# EAGLE design PX2FMU_testjig (EAGLE 5.11)
BOM: EXCLUDE; PARTNO: 93LC46BT-I/ST
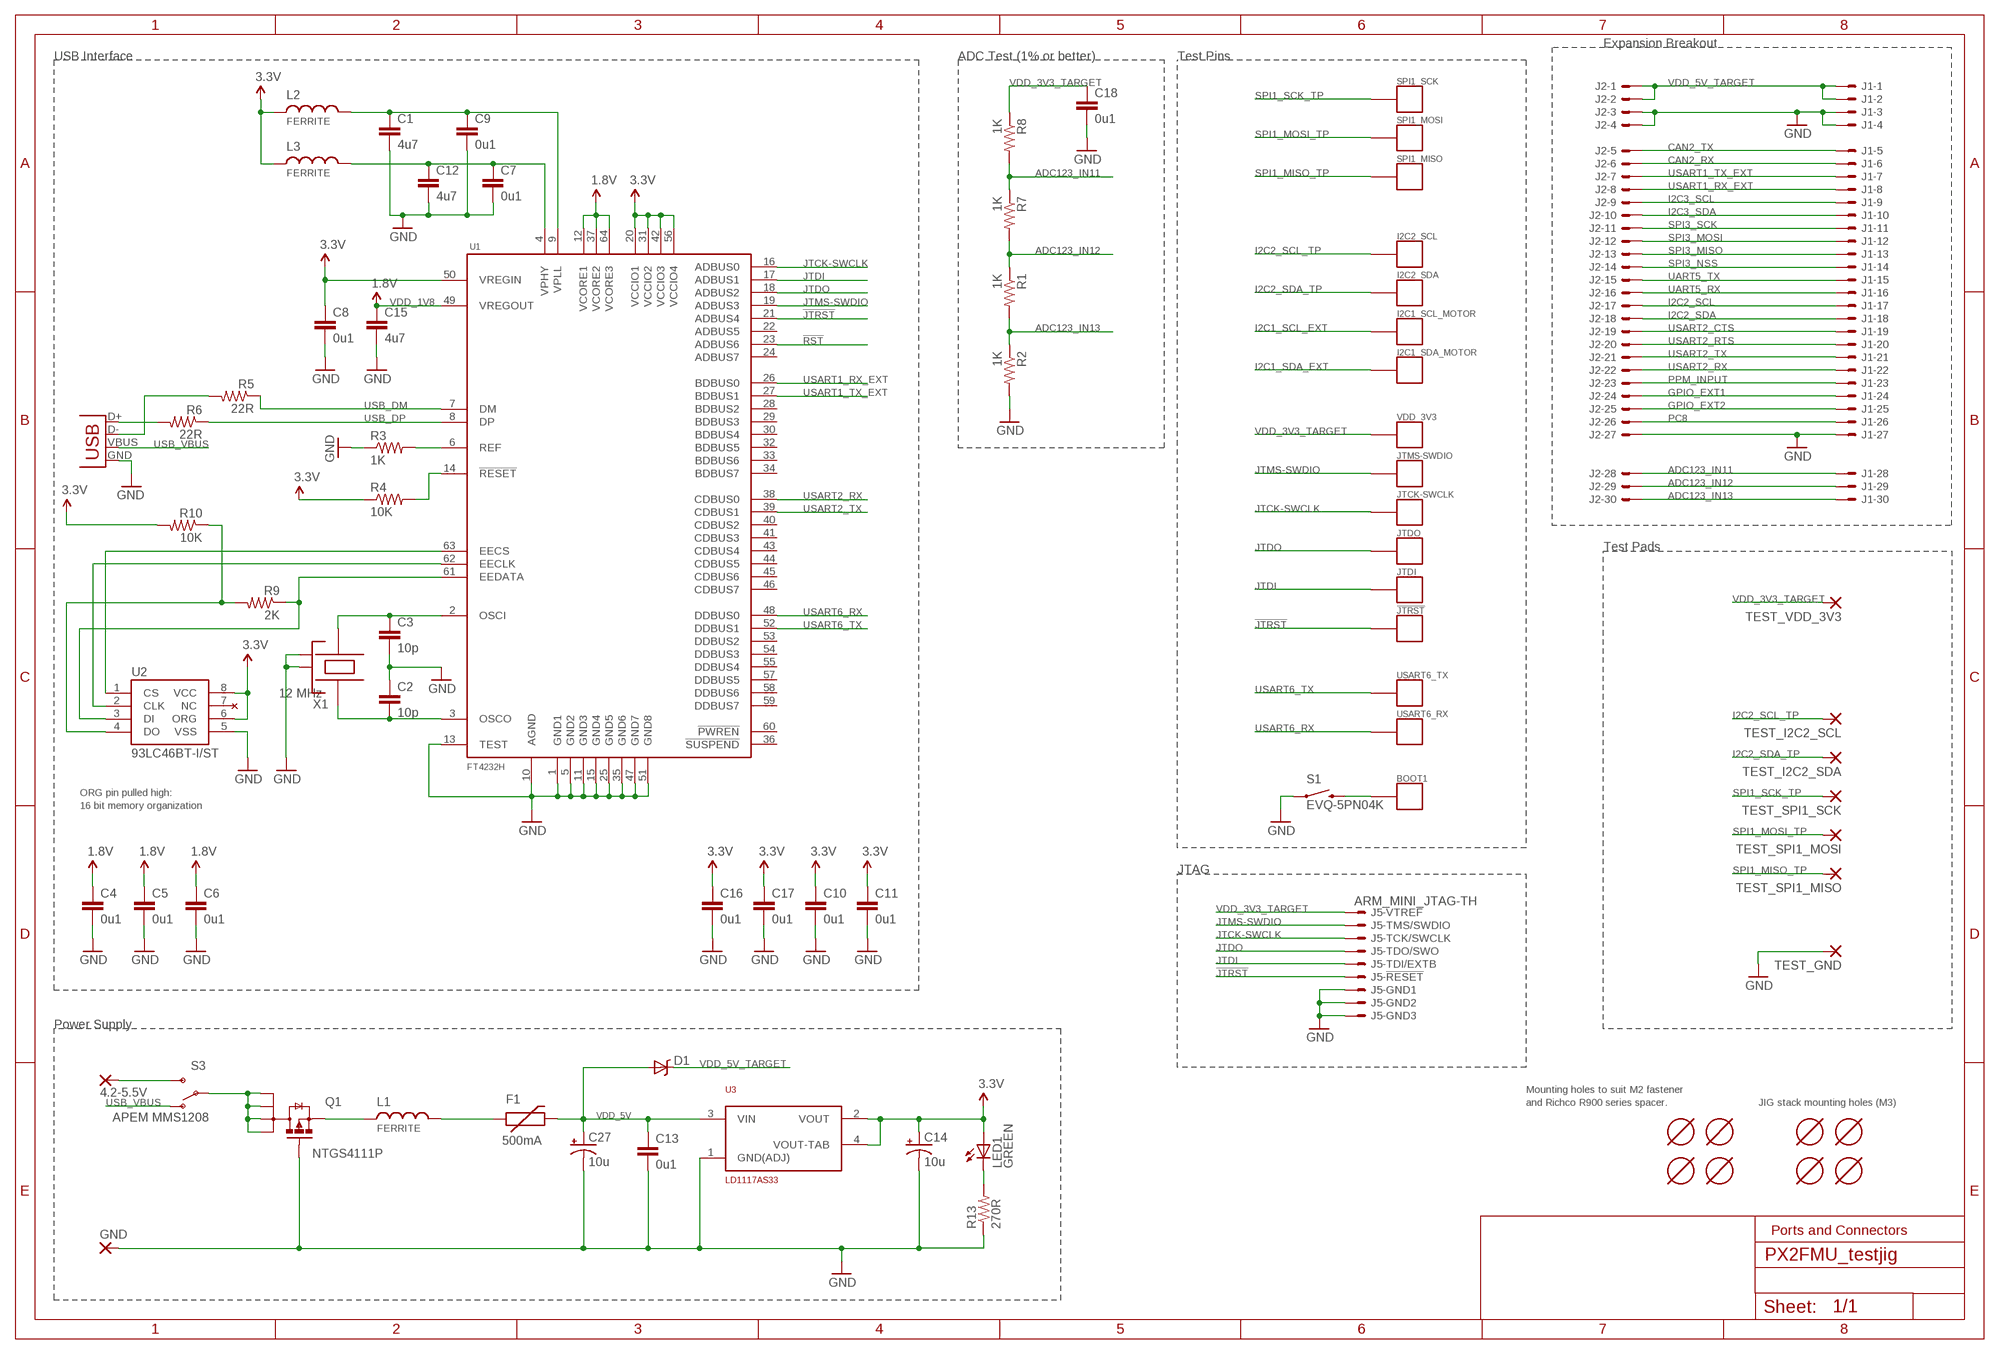
[diagram p0: schematic, sheet 1]

## Parts
4.2-5.5V  WIREPADSMD3,5-2  [3,5-2]
!JTRST  PAD-POGO  [POGO]
BOOT1  PAD-POGO  [POGO]
C1  4u7  CAP0402-CAP  [0402-CAP]
C2  10p  CAP0402-CAP  [0402-CAP]
C3  10p  CAP0402-CAP  [0402-CAP]
C4  0u1  CAP0402-CAP  [0402-CAP]
C5  0u1  CAP0402-CAP  [0402-CAP]
C6  0u1  CAP0402-CAP  [0402-CAP]
C7  0u1  CAP0402-CAP  [0402-CAP]
C8  0u1  CAP0402-CAP  [0402-CAP]
C9  0u1  CAP0402-CAP  [0402-CAP]
C10  0u1  CAP0402-CAP  [0402-CAP]
C11  0u1  CAP0402-CAP  [0402-CAP]
C12  4u7  CAP0402-CAP  [0402-CAP]
C13  0u1  CAP0402-CAP  [0402-CAP]
C14  10u  CAP_POL1206  [EIA3216]
C15  4u7  CAP0402-CAP  [0402-CAP]
C16  0u1  CAP0402-CAP  [0402-CAP]
C17  0u1  CAP0402-CAP  [0402-CAP]
C18  0u1  CAP0402-CAP  [0402-CAP]
C27  10u  CAP_POL1206  [EIA3216]
D1  DIODE-SCHOTTKY_MSMP  [MICROSMP]
F1  500mA  PTC0402  [0402-PTC]
GND  WIREPADSMD3,5-2  [3,5-2]
I2C1_SCL_MOTOR  PAD-POGO  [POGO]
I2C1_SDA_MOTOR  PAD-POGO  [POGO]
I2C2_SCL  PAD-POGO  [POGO]
I2C2_SDA  PAD-POGO  [POGO]
J1  HEADER_2X15  HEADER_2X15-TH-SHROUDED  [HEADER_2.54MM-2X15-SHROUDED_LOCK]
J2  HEADER_2X15-POGO  [HEADER_2MM_2X15_POGO]
J5  ARM_MINI_JTAG-TH  [FTSH-105-01-XXX-DV]
J8  USBSMD  [USB-MINIB]
JTCK-SWCLK  PAD-POGO  [POGO]
JTDI  PAD-POGO  [POGO]
JTDO  PAD-POGO  [POGO]
JTMS-SWDIO  PAD-POGO  [POGO]
L1  FERRITE  INDUCTOR0402  [0402-IND]
L2  FERRITE  INDUCTOR0402  [0402-IND]
L3  FERRITE  INDUCTOR0402  [0402-IND]
LED1  GREEN  LED0603  [LED-0603]
Q1  NTGS4111P  [TSOP-6]
R1  1K  RESISTOR0402-RES  [0402-RES]
R2  1K  RESISTOR0402-RES  [0402-RES]
R3  1K  RESISTOR0402-RES  [0402-RES]
R4  10K  RESISTOR0402-RES  [0402-RES]
R5  22R  RESISTOR0402-RES  [0402-RES]
R6  22R  RESISTOR0402-RES  [0402-RES]
R7  1K  RESISTOR0402-RES  [0402-RES]
R8  1K  RESISTOR0402-RES  [0402-RES]
R9  2K  RESISTOR0402-RES  [0402-RES]
R10  10K  RESISTOR0402-RES  [0402-RES]
R13  270R  RESISTOR0402-RES  [0402-RES]
S1  EVQ-5PN04K  SWITCH-MOMENTARY-2-SMD-1101NE  [TACTILE-SWITCH-1101NE]
S3  APEM MMS1208  SWITCH-SPSTPTH_LOCK  [SWITCH-SPDT_LOCK.007S]
SPI1_MISO  PAD-POGO  [POGO]
SPI1_MOSI  PAD-POGO  [POGO]
SPI1_SCK  PAD-POGO  [POGO]
TEST_GND  WIREPADSMD2.5-1.8  [PAD-2.5-1.8]
TEST_I2C2_SCL  WIREPADSMD2.5-1.8  [PAD-2.5-1.8]
TEST_I2C2_SDA  WIREPADSMD2.5-1.8  [PAD-2.5-1.8]
TEST_SPI1_MISO  WIREPADSMD2.5-1.8  [PAD-2.5-1.8]
TEST_SPI1_MOSI  WIREPADSMD2.5-1.8  [PAD-2.5-1.8]
TEST_SPI1_SCK  WIREPADSMD2.5-1.8  [PAD-2.5-1.8]
TEST_VDD_3V3  WIREPADSMD2.5-1.8  [PAD-2.5-1.8]
U1  FT4232H  [TQFP64]
U2  93LC46BT-I/ST  EEPROM-SERIAL-TSSOP-8  [TSSOP-8]
U3  LD1117AS33  [SOT-223]
U$1  MOUNT-HOLE3.1MM  [MOUNT-HOLE3.1]
U$2  MOUNT-HOLE3.1MM  [MOUNT-HOLE3.1]
U$3  MOUNT-HOLE3.1MM  [MOUNT-HOLE3.1]
U$4  MOUNT-HOLE3.1MM  [MOUNT-HOLE3.1]
U$5  MOUNT-HOLE2.1MM  [MOUNT-HOLE2.1]
U$6  MOUNT-HOLE2.1MM  [MOUNT-HOLE2.1]
U$7  MOUNT-HOLE2.1MM  [MOUNT-HOLE2.1]
U$8  MOUNT-HOLE2.1MM  [MOUNT-HOLE2.1]
USART6_RX  PAD-POGO  [POGO]
USART6_TX  PAD-POGO  [POGO]
VDD_3V3  PAD-POGO  [POGO]
X1  12 MHz  OSCILLATOR-3.2X2.5  [OSCILLATOR-3.2X2.5]

## Nets
!JTRST: !JTRST.P$1 J5.10 U1.21(ADBUS4)
!RST: U1.23(ADBUS6)
ADC123_IN11: J1.28 J2.28 R7.1 R8.2
ADC123_IN12: J1.29 J2.29 R1.1 R7.2
ADC123_IN13: J1.30 J2.30 R1.2 R2.1
BOOT1: BOOT1.P$1 S1.P$2
CAN2_RX: J1.6 J2.6
CAN2_TX: J1.5 J2.5
GND [power]: C1.2 C2.1 C3.2 C4.2 C5.2 C6.2 C7.2 C8.2 C9.2 C10.2 C11.2 C12.2 C13.2 C14.C(-) C15.2 C16.2 C17.2 C18.2 C27.C(-) GND.1(P) J1.3 J1.4 J1.27 J2.3 J2.4 J2.27 J5.3 J5.5 J5.9 J8.GND Q1.3(G) R2.2 R3.1 R13.1 S1.P$1 TEST_GND.P$1(P) U1.1(GND1) U1.5(GND2) U1.10(AGND) U1.11(GND3) U1.13(TEST) U1.15(GND4) U1.25(GND5) U1.35(GND6) U1.47(GND7) U1.51(GND8) U2.5(VSS) U3.1(GND(ADJ)) X1.2(NC_2) X1.4(NC_4)
GPIO_EXT1: J1.24 J2.24
GPIO_EXT2: J1.25 J2.25
I2C1_SCL_EXT: I2C1_SCL_MOTOR.P$1
I2C1_SDA_EXT: I2C1_SDA_MOTOR.P$1
I2C2_SCL: J1.17 J2.17
I2C2_SCL_TP: I2C2_SCL.P$1 TEST_I2C2_SCL.P$1(P)
I2C2_SDA: J1.18 J2.18
I2C2_SDA_TP: I2C2_SDA.P$1 TEST_I2C2_SDA.P$1(P)
I2C3_SCL: J1.9 J2.9
I2C3_SDA: J1.10 J2.10
JTCK-SWCLK: J5.4 JTCK-SWCLK.P$1 U1.16(ADBUS0)
JTDI: J5.8 JTDI.P$1 U1.17(ADBUS1)
JTDO: J5.6 JTDO.P$1 U1.18(ADBUS2)
JTMS-SWDIO: J5.2 JTMS-SWDIO.P$1 U1.19(ADBUS3)
N$1: J8.D- R5.2
N$2: J8.D+ R6.2
N$3: R3.2 U1.6(REF)
N$4 [power]: C1.1 C9.1 L2.2 U1.9(VPLL)
N$5: R4.2 U1.14(!RESET)
N$6 [power]: C7.1 C12.1 L3.2 U1.4(VPHY)
N$7: U1.63(EECS) U2.1(CS)
N$8: U1.62(EECLK) U2.2(CLK)
N$9: R9.1 U1.61(EEDATA) U2.3(DI)
N$10 [power]: F1.1 L1.2
N$11 [power]: L1.1 Q1.4(S)
N$12 [power]: 4.2-5.5V.1(P) S3.3(S)
N$13 [power]: Q1.1(D) Q1.2(D1) Q1.5(D2) Q1.6(D3) S3.2(P)
N$14: R9.2 R10.1 U2.4(DO)
N$19: C3.1 U1.2(OSCI) X1.1
N$20: C2.2 U1.3(OSCO) X1.3
N$29: LED1.C R13.2
PC8: J1.26 J2.26
PPM_INPUT: J1.23 J2.23
SPI1_MISO_TP: SPI1_MISO.P$1 TEST_SPI1_MISO.P$1(P)
SPI1_MOSI_TP: SPI1_MOSI.P$1 TEST_SPI1_MOSI.P$1(P)
SPI1_SCK_TP: SPI1_SCK.P$1 TEST_SPI1_SCK.P$1(P)
SPI3_MISO: J1.13 J2.13
SPI3_MOSI: J1.12 J2.12
SPI3_NSS: J1.14 J2.14
SPI3_SCK: J1.11 J2.11
UART5_RX: J1.16 J2.16
UART5_TX: J1.15 J2.15
USART1_RX_EXT: J1.8 J2.8 U1.26(BDBUS0)
USART1_TX_EXT: J1.7 J2.7 U1.27(BDBUS1)
USART2_CTS: J1.19 J2.19
USART2_RTS: J1.20 J2.20
USART2_RX: J1.22 J2.22 U1.38(CDBUS0)
USART2_TX: J1.21 J2.21 U1.39(CDBUS1)
USART6_RX: U1.48(DDBUS0) USART6_RX.P$1
USART6_TX: U1.52(DDBUS1) USART6_TX.P$1
USB_DM: R5.1 U1.7(DM)
USB_DP: R6.1 U1.8(DP)
USB_VBUS [power]: J8.VBUS S3.1(O)
VDD_1V8 [power]: C4.1 C5.1 C6.1 C15.1 U1.12(VCORE1) U1.37(VCORE2) U1.49(VREGOUT) U1.64(VCORE3) ; supply symbol labelled 1.8V
VDD_3V3 [power]: C8.1 C10.1 C11.1 C14.A(+) C16.1 C17.1 L2.1 L3.1 LED1.A R4.1 R10.2 U1.20(VCCIO1) U1.31(VCCIO2) U1.42(VCCIO3) U1.50(VREGIN) U1.56(VCCIO4) U2.6(ORG) U2.8(VCC) U3.2(VOUT) U3.4(VOUT-TAB) ; supply symbol labelled 3.3V
VDD_3V3_TARGET [power]: C18.1 J5.1 R8.1 TEST_VDD_3V3.P$1(P) VDD_3V3.P$1
VDD_5V [power]: C13.1 C27.A(+) D1.ANODE(A) F1.2 U3.3(VIN)
VDD_5V_TARGET [power]: D1.CATHODE(C) J1.1 J1.2 J2.1 J2.2
Unconnected: U1.22(ADBUS5) U1.24(ADBUS7) U1.28(BDBUS2) U1.29(BDBUS3) U1.30(BDBUS4) U1.32(BDBUS5) U1.33(BDBUS6) U1.34(BDBUS7) U1.36(!SUSPEND) U1.40(CDBUS2) U1.41(CDBUS3) U1.43(CDBUS4) U1.44(CDBUS5) U1.45(CDBUS6) U1.46(CDBUS7) U1.53(DDBUS2) U1.54(DDBUS3) U1.55(DDBUS4) U1.57(DDBUS5) U1.58(DDBUS6) U1.59(DDBUS7) U1.60(!PWREN) U2.7(NC)

## Notes on the sheet
- Expansion Breakout
- USB Interface | ADC Test (1% or better) | Test Pins
- Test Pads
- ORG pin pulled high:
- 16 bit memory organization
- JTAG
- Power Supply
- Mounting holes to suit M2 fastener
- and Richco R900 series spacer. | JIG stack mounting holes (M3)
- Ports and Connectors

## Library data of the parts
4.2-5.5V GND TEST_GND TEST_I2C2_SCL TEST_I2C2_SDA TEST_SPI1_MISO TEST_SPI1_MOSI TEST_SPI1_SCK TEST_VDD_3V3 = pixhawk2:WIREPAD: Wire PAD connect wire on PCB
!JTRST BOOT1 I2C1_SCL_MOTOR I2C1_SDA_MOTOR I2C2_SCL I2C2_SDA JTCK-SWCLK JTDI JTDO JTMS-SWDIO SPI1_MISO SPI1_MOSI SPI1_SCK USART6_RX USART6_TX VDD_3V3 = pixhawk2:PAD: Test pad This footprint includes three classes: The actual test pads, a pogo-pin footprint to mount the pogo-pin as through-hole part and a hole footprint which allows the head of the pogo-pin to pass through (do NOT use the hole to mount the pogo-pin). In a typical test setup, the stack would consist of three PCBs: The actual PCB under testing with a test pad on the bottom, then a second PCB with the hole for the pogo-pin head where the PCB under testing is pressed on and a third PCB at 30 mm / 1.2" distance with the pogo-pin footprints. The pogo-pins are soldered to the last PCB. To create the stack, copy the board under testing and exchange the footprints - this way the correct positioning is ensured.
C1-C13 C15-C18 = pixhawk2:CAP: Capacitor Standard 0603 ceramic capacitor, and 0.1" leaded capacitor.
C14 C27 = pixhawk2:CAP_POL: Capacitor Polarized These are standard SMD and PTH capacitors. Normally 10uF, 47uF, and 100uF in electrolytic and tantalum varieties. Always verify the external diameter of the through hole cap, it varies with capacity, voltage, and manufacturer. The EIA devices should be standard.
D1 = pixhawk2:DIODE-SCHOTTKY: Schottky barrier diode in DO214AC, e.g. Fairchild SS14.
F1 = pixhawk2:PTC: Resettable Fuse PTC Resettable Fuse. Spark Fun Electronics SKU : COM-08357
J1 J2 = pixhawk2:HEADER_2X15: 2X15 header
J5 = pixhawk2:ARM_MINI_JTAG: CONNECTOR wire to board 1.25 mm (.049 inch) pitch header
J8 = pixhawk2:USB: USB Connectors USB-B-PTH is fully proven SKU : PRT-00139 USB-miniB is fully proven SKU : PRT-00587 USB-A-PCB is untested. USB-A-H is throughly reviewed, but untested. Spark Fun Electronics SKU : PRT-00437 USB-B-SMT is throughly reviewed, but untested. Needs silkscreen touching up. USB-A-S has not been used/tested USB-MB-H has not been used/tested
L1-L3 = pixhawk2:INDUCTOR: Inductors Basic Inductor/Choke - 0603 and 1206. Footprints are not proven and vary greatly between part numbers.
LED1 = pixhawk2:LED: LEDs Standard schematic elements and footprints for 5mm, 3mm, 1206, and 0603 sized LEDs. 5mm - Spark Fun Electronics SKU : COM-00529 (and others)
Q1 = pixhawk2:NTGS4111P
R1-R10 R13 = pixhawk2:RESISTOR: Resistor Basic schematic elements and footprints for 0603, 1206, and PTH 1/10th watt (small) resistors.
S1 = pixhawk2:SWITCH-MOMENTARY-2
S3 = pixhawk2:SWITCH-SPST: SPST Switch Simple slide switch. Spark Fun Electronics SKU : COM-00102
U1 = pixhawk2:FT4232H
U2 = pixhawk2:EEPROM-SERIAL: Serial EEPROM (SPI / Microwire) This is a standard footprint for SPI / Microwire serial EEPROMs. Matching parts include: Microchip Technology 93LC46BT-I/ST: 1K, 16 bit (64x16), 2 MHz, 2.5 - 5.5 V
U3 = pixhawk2:LD1117A: LD1117A LDO Datasheet: http://www.st.com/stonline/books/pdf/docs/7194.pdf
U$1-U$8 = pixhawk2:MOUNT-HOLE
X1 = pixhawk2:OSCILLATOR: Crystal Oscillator in 3.2x2.5 SMD

## Net classes
0 signal: width 0.203 mm, drill 0.3 mm, clearance 0.203 mm
1 power: width 0.254 mm, drill 0.3 mm, clearance 0.203 mm

## Board
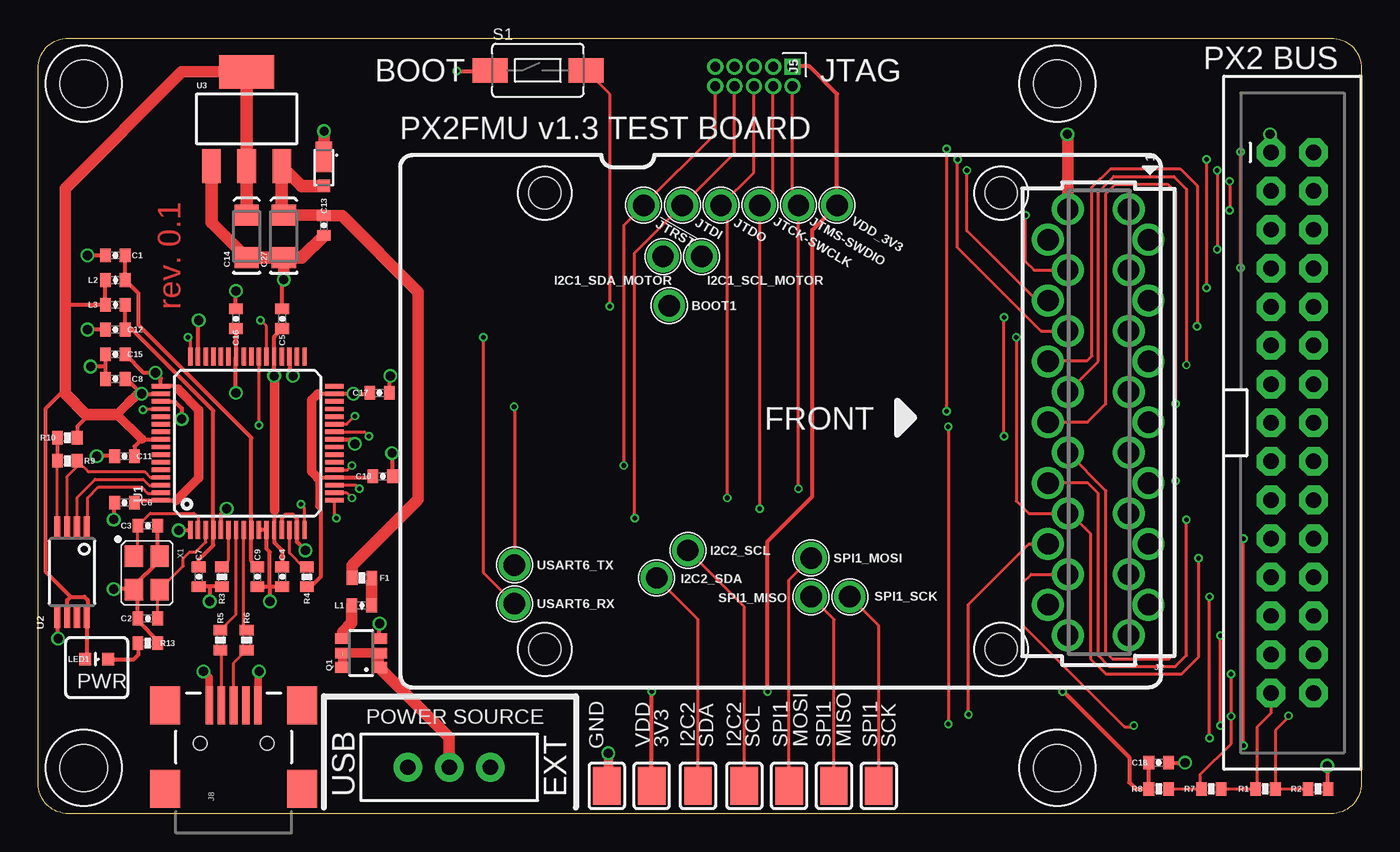
[diagram p1: board, top side]
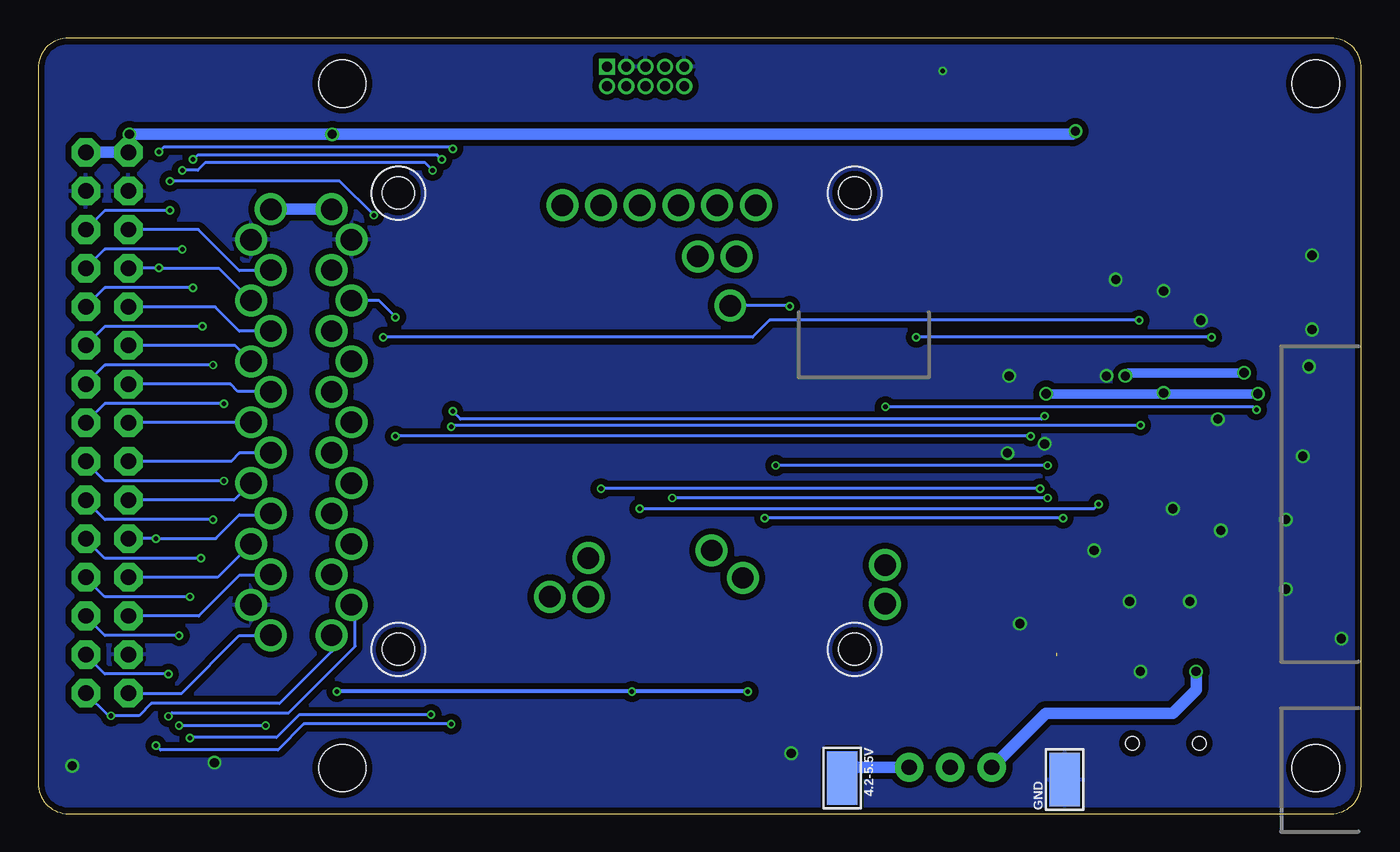
[diagram p2: board, bottom side, seen from below]

Size 87 x 51 mm. Coordinates in mm from the lower left corner, seen from the top.
Outline: 0,49 arc-90 2,51 85,51 arc-90 87,49 87,2 arc-90 85,0 2,0 arc-90 0,2 0,49
Copper layers (1*2*15*16): Top 0.035mm / dielectric 0.5mm / Route2 0.035mm / dielectric 0.5mm / Route15 0.035mm / dielectric 0.5mm / Bottom 0.035mm
Design rules "pixhawk2": minimum track width 0.15mm, minimum drill 0.3mm, track to track 0.15mm, track to pad 0.15mm, pad to pad 0.15mm, via to via 0.15mm, smd to smd 0.15mm, copper to edge 0.2mm, drill to drill 0.2mm, minimum pad ring 0.125mm, minimum via ring 0.125mm, stop-mask expansion 1mil, vias tented up to drill 0.31mm, thermal gap 8mil

### Footprints (pad centres in the part's own frame; a part is rotated, then mirrored left to right if it is on the bottom)
3,5-2 = smd 2 x 3.5: 1 0,0
POGO = drill 1.4 pad 2 round: P$1 0,0
0402-CAP = smd 0.7 x 0.9: 1 -0.65,0; 2 0.65,0
EIA3216 = smd 1.4 x 1.6: A 1.4,0; C -1.4,0
MICROSMP = smd 0.8 x 0.8: ANODE 0.65,0 | smd 2 x 1.1: CATHODE -1.25,0
0402-PTC = smd 0.7 x 0.9: 1 -0.65,0; 2 0.65,0
HEADER_2.54MM-2X15-SHROUDED_LOCK = drill 1.016 pad 1.88 octagon: 1 -1.397,17.78; 2 1.397,17.78; 3 -1.397,15.24; 4 1.397,15.24; 5 -1.397,12.7; 6 1.397,12.7; 7 -1.397,10.16; 8 1.397,10.16; 9 -1.397,7.62; 10 1.397,7.62; 11 -1.397,5.08; 12 1.397,5.08; 13 -1.397,2.54; 14 1.397,2.54; 15 -1.397,0; 16 1.397,0; 17 -1.397,-2.54; 18 1.397,-2.54; 19 -1.397,-5.08; 20 1.397,-5.08; 21 -1.397,-7.62; 22 1.397,-7.62; 23 -1.397,-10.16; 24 1.397,-10.16; 25 -1.397,-12.7; 26 1.397,-12.7; 27 -1.397,-15.24; 28 1.397,-15.24; 29 -1.397,-17.78; 30 1.397,-17.78
HEADER_2MM_2X15_POGO = drill 1.4 pad 2 round: 1 14,-2; 2 14,2; 3 12,-3.3; 4 12,3.3; 5 10,-2; 6 10,2; 7 8,-3.3; 8 8,3.3; 9 6,-2; 10 6,2; 11 4,-3.3; 12 4,3.3; 13 2,-2; 14 2,2; 15 0,-3.3; 16 0,3.3; 17 -2,-2; 18 -2,2; 19 -4,-3.3; 20 -4,3.3; 21 -6,-2; 22 -6,2; 23 -8,-3.3; 24 -8,3.3; 25 -10,-2; 26 -10,2; 27 -12,-3.3; 28 -12,3.3; 29 -14,-2; 30 -14,2
FTSH-105-01-XXX-DV = drill 0.65 pad 1.06 square: 1 0,0 | drill 0.65 pad 1.06 round: 2 0,1.27; 3 1.27,0; 4 1.27,1.27; 5 2.54,0; 6 2.54,1.27; 7 3.81,0; 8 3.81,1.27; 9 5.08,0; 10 5.08,1.27
USB-MINIB = smd 2.5 x 0.5: D+ 2.5,0; D- 2.5,0.8; GND 2.5,-1.6; ID 2.5,-0.8; VBUS 2.5,1.6 | smd 2.5 x 2: GND@1 -3,-4.5; GND@2 -3,4.5; GND@3 2.5,4.5; GND@4 2.5,-4.5 | hole 0.9: 0,2.2; 0,-2.2
0402-IND = smd 0.7 x 0.9: 1 -0.65,0; 2 0.65,0
LED-0603 = smd 0.8 x 0.8: A 0,-0.75; C 0,0.75
TSOP-6 = smd 0.7 x 1: 1 -0.95,-1.2; 2 0,-1.2; 3 0.95,-1.2; 4 0.95,1.2; 5 0,1.2; 6 -0.95,1.2
0402-RES = smd 0.7 x 0.9: 1 -0.65,0; 2 0.65,0
TACTILE-SWITCH-1101NE = smd 2.3 x 1.6: P$1 -3.15,0; P$2 3.15,0
SWITCH-SPDT_LOCK.007S = drill 1.016 pad 1.88 round: 1 0,2.718; 2 0,0; 3 0,-2.718
PAD-2.5-1.8 = smd 1.8 x 2.5: P$1 0,0
TQFP64 = smd 1.2 x 0.29: 1 -5.7,3.75; 2 -5.7,3.25; 3 -5.7,2.75; 4 -5.7,2.25; 5 -5.7,1.75; 6 -5.7,1.25; 7 -5.7,0.75; 8 -5.7,0.25; 9 -5.7,-0.25; 10 -5.7,-0.75; 11 -5.7,-1.25; 12 -5.7,-1.75; 13 -5.7,-2.25; 14 -5.7,-2.75; 15 -5.7,-3.25; 16 -5.7,-3.75; 33 5.7,-3.75; 34 5.7,-3.25; 35 5.7,-2.75; 36 5.7,-2.25; 37 5.7,-1.75; 38 5.7,-1.25; 39 5.7,-0.75; 40 5.7,-0.25; 41 5.7,0.25; 42 5.7,0.75; 43 5.7,1.25; 44 5.7,1.75; 45 5.7,2.25; 46 5.7,2.75; 47 5.7,3.25; 48 5.7,3.75 | smd 0.29 x 1.2: 17 -3.75,-5.7; 18 -3.25,-5.7; 19 -2.75,-5.7; 20 -2.25,-5.7; 21 -1.75,-5.7; 22 -1.25,-5.7; 23 -0.75,-5.7; 24 -0.25,-5.7; 25 0.25,-5.7; 26 0.75,-5.7; 27 1.25,-5.7; 28 1.75,-5.7; 29 2.25,-5.7; 30 2.75,-5.7; 31 3.25,-5.7; 32 3.75,-5.7; 49 3.75,5.7; 50 3.25,5.7; 51 2.75,5.7; 52 2.25,5.7; 53 1.75,5.7; 54 1.25,5.7; 55 0.75,5.7; 56 0.25,5.7; 57 -0.25,5.7; 58 -0.75,5.7; 59 -1.25,5.7; 60 -1.75,5.7; 61 -2.25,5.7; 62 -2.75,5.7; 63 -3.25,5.7; 64 -3.75,5.7
TSSOP-8 = smd 1.45 x 0.4: 1 2.95,-0.975; 2 2.95,-0.325; 3 2.95,0.325; 4 2.95,0.975; 5 -2.95,0.975; 6 -2.95,0.325; 7 -2.95,-0.325; 8 -2.95,-0.975
SOT-223 = smd 1.219 x 2.235: 1 -2.311,-3.099; 2 0,-3.099; 3 2.311,-3.099 | smd 3.6 x 2.2: 4 0,3.099
MOUNT-HOLE3.1 = hole 3.1: 0,0
MOUNT-HOLE2.1 = hole 2.1: 0,0
OSCILLATOR-3.2X2.5 = smd 1.4 x 1.2: 1 -1.1,-0.85; 2 1.1,-0.85; 3 1.1,0.85; 4 -1.1,0.85

### Placement (x,y rotation side)
4.2-5.5V  34.14,2.34 180 bottom
!JTRST  39.82,40 315 top
BOOT1  41.5,33.4 0 top
C1  5.08,36.71 180 top
C2  7.21,12.83 0 top
C3  7.21,18.93 0 top
C4  16.05,15.58 270 top
C5  16.05,32.54 90 top
C6  5.69,20.45 180 top
C7  10.57,15.58 270 top
C8  5.08,28.58 180 top
C9  14.43,15.58 270 top
C10  22.66,22.18 0 top
C11  5.69,23.5 180 top
C12  5.08,31.83 180 top
C13  18.8,38.67 270 top
C14  13.72,37.96 90 top
C15  5.08,30.21 180 top
C16  13,32.54 90 top
C17  22.45,27.67 0 top
C18  73.68,3.35 0 top
C27  16.15,37.96 90 top
D1  18.8,41.92 270 top
F1  21.29,15.5 180 top
GND  19.51,2.24 0 bottom
I2C1_SCL_MOTOR  43.63,36.64 0 top
I2C1_SDA_MOTOR  41.09,36.64 0 top
I2C2_SCL  42.72,17.3 0 top
I2C2_SDA  40.67,15.5 0 top
J1  82.46,25.7 0 top
J2  69.7,25.74 90 top
J5  49.6,49.1 180 top
J8  12.86,4.63 90 top
JTCK-SWCLK  47.45,40 315 top
JTDI  42.36,40 315 top
JTDO  44.9,40 315 top
JTMS-SWDIO  49.99,40 315 top
L1  21.28,13.69 0 top
L2  5.08,35.08 0 top
L3  5.08,33.46 0 top
LED1  3.86,10.16 270 top
Q1  21.23,10.57 90 top
R1  80.69,1.63 0 top
R2  84.14,1.63 0 top
R3  12.09,15.58 90 top
R4  17.68,15.58 90 top
R5  11.99,11.41 270 top
R6  13.72,11.41 270 top
R7  77.13,1.63 0 top
R8  73.68,1.63 0 top
R9  1.93,23.2 180 top
R10  1.93,24.72 0 top
R13  7.21,11.21 180 top
S1  32.86,48.88 0 top
S3  27.03,3.05 90 top
SPI1_MISO  50.82,14.26 315 top
SPI1_MOSI  50.82,16.8 0 top
SPI1_SCK  53.36,14.26 315 top
TEST_GND  37.39,1.83 0 top
TEST_I2C2_SCL  46.43,1.83 0 top
TEST_I2C2_SDA  43.38,1.83 0 top
TEST_SPI1_MISO  52.32,1.83 0 top
TEST_SPI1_MOSI  49.38,1.83 0 top
TEST_SPI1_SCK  55.27,1.83 0 top
TEST_VDD_3V3  40.34,1.83 0 top
U1  13.77,24.36 90 top
U2  2.24,15.88 90 top
U3  13.72,45.68 0 top
U$1  3,3 0 top
U$2  3,48 0 top
U$3  67,48 0 top
U$4  67,3 0 top
U$5  33.32,40.8 0 top
U$6  33.32,10.8 0 top
U$7  63.32,40.8 0 top
U$8  63.32,10.8 0 top
USART6_RX  31.32,13.8 0 top
USART6_TX  31.32,16.34 0 top
VDD_3V3  52.53,40 315 top
X1  7.16,15.84 270 top

### Tracks (layer width: path | path; a pad name or v marks a point on that pad's centre or on a via)
!JTRST  (via drill 0.3)
  Top 0.203: J5.10 44.52,44.7 !JTRST.P$1 38.51,38.69 v38.51,22.89 | U1.21 20.34,22.61 v20.62,22.89
  Bottom 0.203: v20.62,22.89 v38.51,22.89
ADC123_IN11  (via drill 0.3)
  Top 0.203: v78.44,9.18 v78.44,6.4 78.44,4.6 76.4,2.57 76.4,1.7 R7.1 R8.2
  Bottom 0.203: v78.44,9.18 82.6,9.18 83.85,10.43 J1.28 | J2.28 66.14,13.48 66.14,11.01 70.51,6.64 78.2,6.64 v78.44,6.4
ADC123_IN12
  Top 0.203: R7.2 R1.1 | 80.16,1.76 80.16,5.72 81.06,6.62 J1.29
  Top 0.254: 80.16,1.76 80.16,1.75 R1.1
  Bottom 0.203: J2.29 71.72,11.72 73.76,11.72 77.55,7.92 J1.29
ADC123_IN13  (via drill 0.3)
  Top 0.203: R2.1 R1.2 81.34,5.47 82.19,6.33 82.19,6.43 82.23,6.39 82.25,6.39 v82.21,6.43
  Bottom 0.203: J1.30 82.36,6.43 v82.21,6.43 80.37,6.43 79.55,7.25 71.12,7.25 67.7,10.67 J2.30
BOOT1  (via drill 0.3)
  Top 0.203: S1.P$2 37.59,47.29 v37.59,33.36
  Bottom 0.203: v37.59,33.36 37.63,33.4 BOOT1.P$1
CAN2_RX  (via drill 0.3)
  Top 0.203: J2.6 65.49,35.74 64.92,36.3 v64.92,39.35 | v78.33,41.59 v78.33,39.66
  Bottom 0.203: J1.6 82.6,39.66 v78.33,39.66 | v64.92,39.35 67.16,41.59 v78.33,41.59
CAN2_TX
  Bottom 0.203: J2.5 71.74,35.69 73.76,35.69 76.47,38.4 J1.5
GND  (via drill 0.3, 0.6)
  Top 0.254: C3.2 7.86,17.08 X1.4 7.92,16.86 7.92,16.59 6.3,14.97 | U1.10 U1.11 15.02,17.42 15.24,17.2 15.24,14.93 | 6.3,14.97 X1.2 6.56,14.48 C2.1 6.6,12.79 6.6,12.63 7.86,11.37 R13.1 | R2.2 84.79,3.11 v84.75,3.15 | U1.51 8.99,27.11 9.45,26.65 v9.45,25.94 | U1.5 12.02,19.68 v12.39,20.05 | U1.1 9.99,18.62 v9.25,18.62 | 6.3,14.97 6.1,14.76 v4.98,14.76 | U1.47 10.52,32.4 v10.57,32.44 | C11.2 v3.86,23.5 | U1.25 20.54,24.61 v20.83,24.31 | C10.2 23.31,23.66 v23.27,23.7 | TEST_GND.P$1 37.49,1.93 | C18.2 v75.4,3.35 | Q1.3 22.43,12.48 v22.45,12.5 | S1.P$1 29.67,48.83 v27.53,48.83 | C16.2 v13.01,34.37 | U1.35 16.52,29.02 v16.76,28.79 | v17.58,17.3 17.02,17.86 U1.15 17.02,19.38 16.76,19.64 16.26,19.64 16.02,19.41 U1.13 | C17.2 23.1,28.72 v23.16,28.79 | C1.2 v3.25,36.71 | C12.2 v3.25,31.83 | C15.2 4.43,29.39 | 4.43,29.39 C8.2 | 4.43,29.39 v3.45,29.39 | U2.5 1.26,11.57 v1.32,11.51 | C9.2 15.24,14.93 | 15.24,14.93 C4.2 | 15.24,14.93 v15.24,13.95 | R3.1 11.28,14.93 | 11.28,14.93 C7.2 | 11.28,14.93 v11.28,13.95 | C6.2 4.98,20.45 v4.98,19.34 | C5.2 16.05,35.01 v16.15,35.12
  Top 0.508: J8.GND 14.46,9.28 v14.53,9.35
  Top 0.61: 37.49,1.93 v37.49,3.96
  Top 0.762: v16.15,35.12 C27.C
  Top 0.813: U3.1 11.4,38.87 C14.C C27.C 17.34,36.56 C13.2
  Bottom 0.254: v84.75,3.15 84.65,3.15
  pour Bottom (isolate 0.406): 0,50.97 86.92,50.97 86.92,0 0,0
GPIO_EXT1  (via drill 0.3)
  Top 0.203: J2.24 65.15,17.74 61.16,13.75 v61.16,6.5 | v77.01,4.98 v77.01,14.26
  Bottom 0.203: v77.01,14.26 82.6,14.26 83.85,15.51 J1.24 | v61.16,6.5 69.83,6.5 71.32,5.01 77.01,5.01 v77.01,4.98
GPIO_EXT2
  Bottom 0.203: J2.25 71.76,15.68 73.76,15.68 76.44,13 J1.25
I2C2_SCL
  Bottom 0.203: J2.17 71.73,23.7 73.76,23.7 74.3,23.16 J1.17
I2C2_SCL_TP
  Top 0.203: I2C2_SCL.P$1 46.43,13.59 TEST_I2C2_SCL.P$1
I2C2_SDA  (via drill 0.3)
  Top 0.203: v74.78,21.88 74.78,10.6 74.37,10.19 70.61,10.19 70.21,10.6 70.21,21.23 J2.18
  Bottom 0.203: v74.78,21.88 82.6,21.88 83.85,23.13 J1.18
I2C2_SDA_TP
  Top 0.203: I2C2_SDA.P$1 43.38,12.79 TEST_I2C2_SDA.P$1
I2C3_SCL
  Bottom 0.203: J2.9 73.76,31.73 75.35,33.32 J1.9
I2C3_SDA  (via drill 0.3)
  Top 0.203: J2.10 65.93,31.74 60.45,37.22 v60.45,43.01 | v76.81,43.01 v76.81,34.58
  Bottom 0.203: J1.10 82.6,34.58 v76.81,34.58 | v60.45,43.01 60.76,43.31 76.5,43.31 v76.81,43.01
JTCK-SWCLK  (via drill 0.3)
  Top 0.203: J5.4 48.33,40.88 JTCK-SWCLK.P$1 v47.45,20.05 | U1.16 17.52,20.1 v17.27,20.35
  Bottom 0.203: v17.27,20.35 17.58,20.05 v47.45,20.05
JTDI  (via drill 0.3)
  Top 0.203: J5.8 45.79,43.43 JTDI.P$1 39.22,36.86 v39.22,19.44 | U1.17 19.47,19.57 v19.61,19.44
  Bottom 0.203: v19.61,19.44 v39.22,19.44
JTDO  (via drill 0.3)
  Top 0.203: J5.6 47.06,42.16 JTDO.P$1 45.31,39.59 v45.31,20.76 | U1.18 20.28,21.11 v20.62,20.76
  Bottom 0.203: v20.62,20.76 v45.31,20.76
JTMS-SWDIO  (via drill 0.3)
  Top 0.203: J5.2 49.6,40.39 JTMS-SWDIO.P$1 v49.99,21.37 | U1.19 20.89,21.61 v21.13,21.37
  Bottom 0.203: v21.13,21.37 v49.99,21.37
N$1
  Top 0.203: R5.2 12.06,10.69 J8.D-
N$2
  Top 0.203: R6.2 12.86,9.9 J8.D+
N$3
  Top 0.203: R3.2 12.52,16.66 U1.6
N$4
  Top 0.254: C1.1 L2.2 6.6,34.21 6.6,32.14 14.02,24.72 U1.9 14.02,16.63 C9.1
N$5
  Top 0.203: R4.2 17.64,16.19 17.48,16.19 16.52,17.14 U1.14
N$6
  Top 0.254: L3.2 C12.1 6.2,31.83 11.52,26.51 U1.4 11.52,17.65 10.57,16.69 C7.1
N$7
  Top 0.203: U2.1 3.25,18.83 3.25,20.76 3.96,21.47 6.81,21.47 7.21,21.06 8.03,21.06 U1.63
N$8
  Top 0.203: U2.2 2.56,20.78 3.76,21.98 6.91,21.98 7.32,21.57 8.04,21.57 U1.62
N$9
  Top 0.203: U2.3 1.91,22.16 2.54,22.79 2.54,23.16 R9.1 3.29,22.49 7.01,22.49 7.39,22.11 U1.61
N$10
  Top 0.381: 21.93,15.28 21.93,15.48 F1.1
  Top 0.762: 21.93,15.28 L1.2
N$11
  Top 0.762: Q1.4 20.03,11.6 20.02,11.61 20.02,11.92 20.63,12.53 L1.1
N$12
  Bottom 0.762: S3.3 33.43,3.05 4.2-5.5V.1
N$13  (1 unrouted)
  Top 0.254: 20.03,10.38 20.22,10.57
  Top 0.61: Q1.6 20.03,10.38 | Q1.5 Q1.2 Q1.1
  Top 0.762: Q1.1 27.03,5.03 S3.2
N$14
  Top 0.203: U2.4 1.26,23.18 R9.2
  Top 0.254: R9.2 R10.1
N$19
  Top 0.203: X1.1 6.56,17.2 C3.1 7.38,19.74 10.26,19.74 10.52,19.48 U1.2
N$20
  Top 0.203: C2.2 7.86,14.6 X1.3 9.55,16.28 9.55,16.8 9.96,17.2 10.36,17.2 11.02,17.86 U1.3
N$29
  Top 0.254: LED1.C 6.3,10.16 6.6,10.46 6.6,11.17 R13.2
PC8  (via drill 0.3)
  Top 0.203: J2.26 65.29,15.74 64.72,15.17 64.72,12.43 71.42,5.72 71.97,5.72 v72.03,5.79 | v77.72,5.79 v77.72,11.72
  Bottom 0.203: v77.72,11.72 82.6,11.72 83.85,12.97 J1.26 | v72.03,5.79 v77.72,5.79
PPM_INPUT
  Bottom 0.203: J2.23 75.19,15.54 J1.23
SPI1_MISO_TP
  Top 0.203: SPI1_MISO.P$1 52.32,12.76 TEST_SPI1_MISO.P$1
SPI1_MOSI_TP
  Top 0.203: SPI1_MOSI.P$1 49.38,15.36 TEST_SPI1_MOSI.P$1
SPI1_SCK_TP
  Top 0.203: SPI1_SCK.P$1 55.27,12.35 TEST_SPI1_SCK.P$1
SPI3_MISO
  Bottom 0.203: J2.13 71.73,27.77 73.86,27.77 74.34,28.24 J1.13
SPI3_MOSI  (via drill 0.3)
  Top 0.203: J2.12 66.46,29.8 68.99,29.8 69.29,30.11 69.29,41.18 70.51,42.4 75.08,42.4 76.2,41.28 v76.2,32.04
  Bottom 0.203: J1.12 82.6,32.04 v76.2,32.04
SPI3_NSS  (via drill 0.3)
  Top 0.203: J2.14 69.7,29.74 69.7,40.88 70.71,41.89 74.68,41.89 75.49,41.08 v75.49,29.5
  Bottom 0.203: J1.14 82.6,29.5 v75.49,29.5
SPI3_SCK
  Bottom 0.203: J2.11 74.04,30.78 J1.11
UART5_RX  (via drill 0.3)
  Top 0.203: v74.78,26.96 74.78,40.88 74.27,41.38 70.81,41.38 70.21,40.77 70.21,26.96 68.99,25.74 J2.16
  Bottom 0.203: J1.16 82.6,26.96 v74.78,26.96
UART5_TX
  Bottom 0.203: J2.15 73.03,25.7 J1.15
USART1_RX_EXT  (via drill 0.3)
  Top 0.203: J2.8 65.66,33.74 61.06,38.34 v61.06,42.3 | v77.52,42.3 v77.52,37.12 | U1.26 21.46,25.11 v21.74,24.82 | v63.5,24.82 v63.5,32.65
  Bottom 0.203: J1.8 82.6,37.12 v77.52,37.12 | v61.06,42.3 61.57,42.81 76,42.81 76.5,42.3 v77.52,42.3 | v21.74,24.82 v63.5,24.82 | v63.5,32.65 64.59,33.74 J2.8
USART1_TX_EXT  (via drill 0.3)
  Top 0.203: U1.27 20.29,25.61 v20.83,26.14 | v59.74,26.45 v59.74,43.72 | v79.05,43.52 v79.05,35.9 79.05,35.86
  Bottom 0.203: J2.7 75.12,35.86 79.01,35.86 v79.05,35.9 79.08,35.86 J1.7 | v20.83,26.14 21.03,25.94 59.23,25.94 v59.74,26.45 | v59.74,43.72 59.84,43.82 78.74,43.82 v79.05,43.52 | v79.05,43.52 78.84,43.72 v79.05,43.52
USART2_CTS
  Bottom 0.203: J2.19 74.11,20.62 J1.19
USART2_RTS  (via drill 0.3)
  Top 0.203: v75.49,19.34 75.49,10.39 74.78,9.68 70.41,9.68 69.7,10.39 69.7,21.06 69.02,21.74 J2.20
  Bottom 0.203: v75.49,19.34 82.6,19.34 83.85,20.59 J1.20
USART2_RX  (via drill 0.3)
  Top 0.203: v76.3,16.8 76.3,10.29 75.18,9.18 70.21,9.18 69.19,10.19 69.19,18.42 67.87,19.74 J2.22 65.13,19.74 64.31,20.55 v64.31,31.33 | U1.38 15.02,32.05 v14.63,32.44
  Bottom 0.203: v76.3,16.8 82.6,16.8 83.85,18.05 J1.22 | v14.63,32.44 38.91,32.44 40.03,31.33 v64.31,31.33
USART2_TX  (via drill 0.3)
  Top 0.203: U1.39 v14.52,25.54 v14.53,25.53 | v59.84,25.43 v59.84,5.89 | v79.25,4.47 v79.25,18.08
  Bottom 0.203: J2.21 71.79,19.64 73.76,19.64 75.32,18.08 v79.25,18.08 J1.21 | v14.53,25.53 59.74,25.53 v59.84,25.43 | v59.84,5.89 69.53,5.89 71.22,4.2 78.94,4.2 79.25,4.5 v79.25,4.47
USART6_RX  (via drill 0.3)
  Top 0.203: USART6_RX.P$1 29.26,15.86 v29.26,31.33 | U1.48 10.02,31.16 v9.86,31.33
  Bottom 0.203: v9.86,31.33 v29.26,31.33
USART6_TX  (via drill 0.3)
  Top 0.203: USART6_TX.P$1 31.32,26.73 v31.29,26.75 | v6.91,26.55 6.97,26.61 U1.52
  Bottom 0.203: v6.91,26.55 7.11,26.75 v31.29,26.75
USB_DM
  Top 0.203: R5.1 13.02,13.1 U1.7
USB_DP
  Top 0.203: R6.1 13.52,12.25 U1.8
USB_VBUS  (via drill 0.6)
  Top 0.508: J8.VBUS 11.26,8.96 v10.87,9.35
  Bottom 0.762: v10.87,9.35 10.87,8.13 12.39,6.6 20.75,6.6 S3.1
VDD_1V8  (via drill 0.6)
  Top 0.254: 9.1,20.61 U1.64 6.49,20.61 6.49,20.6 C6.1 | 9.21,27.9 9.01,28.11 U1.49 8.07,28.64 v7.72,28.99 6.95,28.99 C15.1 | 15.54,28.76 v15.52,28.79 U1.37 15.52,31.37 C5.1 | 15.54,19.95 15.52,19.93 U1.12 15.52,17.83 16.05,17.3 C4.1
  Top 0.61: 9.1,20.61 10.57,22.08 10.57,26.55 9.21,27.9 | 15.54,28.76 15.54,19.95
  Bottom 0.61: v7.72,28.99 15.32,28.99 v15.52,28.79
VDD_3V3  (via drill 0.6)
  Top 0.254: U1.56 6.81,24.61 6.81,24.62 6.34,24.15 C11.1 | C10.1 21.93,22.11 U1.20 18.36,22.11 | v13.01,27.67 13.01,30.04 U1.42 13.02,31.87 C16.1 | U1.50 v6.81,27.61 5.83,28.58 C8.1 | 18.39,27.61 U1.31 v20.73,27.61 21.74,27.61 C17.1 | 5.89,26.96 5.89,27 | L2.1 L3.1 1.78,33.46 | 18.34,22.13 18.34,20.2 18.59,19.95 18.59,15.58 17.98,14.97 17.72,14.97 R4.1 | R10.2 2.58,25.47 3.35,26.25 | U2.6 1.91,14.03 2.13,14.26 | 2.13,14.26 3.05,14.26 3.25,14.05 3.25,12.97 U2.8 | U2.8 3.21,10.26 LED1.A | U2.8 | 2.13,14.26 0.51,15.88 0.51,26.65 1.63,27.77 1.78,27.77
  Top 0.61: 18.36,22.11 18.34,22.13 17.98,22.49 17.98,27.2 18.39,27.61 | 9.45,48.78 9.4,48.78 | v6.81,27.61 6.54,27.61 5.89,26.96 5.18,26.25 6.81,24.62
  Top 0.762: 5.18,26.25 3.35,26.25 3.15,26.25 1.78,27.62 1.78,27.77 1.78,33.46 1.78,41.11 9.45,48.78 U3.4
  Top 0.813: U3.4 U3.2 C14.A
  Bottom 0.254: 13.06,27.61 v13.01,27.67 12.95,27.61
  Bottom 0.61: 13.06,27.61 v20.73,27.61 | v6.81,27.61 12.95,27.61
VDD_3V3_TARGET  (via drill 0.3)
  Top 0.254: J5.1 49.63,49.14 50.7,49.14 52.53,47.31 VDD_3V3.P$1 50.9,38.38 50.9,20.86 47.95,17.91 v47.95,8.03 | TEST_VDD_3V3.P$1 v40.34,8.03 | C18.1 R8.1 72.15,1.63 71.73,2.05 71.73,3.69 67.39,8.03 v67.36,8.03
  Bottom 0.254: v40.34,8.03 v47.95,8.03 v67.36,8.03
VDD_5V
  Top 0.254: C27.A 16.03,39.49 | C13.1 18.76,39.36
  Top 0.762: 18.76,39.36 C27.A | F1.2 20.64,16.31 24.99,20.66 24.99,34.3 19.98,39.32 C13.1
  Top 0.813: 16.03,39.49 U3.3 17.34,41.27 D1.ANODE
VDD_5V_TARGET  (via drill 0.6)
  Top 0.254: v80.99,44.67 81.06,44.6 | v67.67,44.67 67.7,44.63
  Top 0.762: D1.CATHODE v18.8,44.87 | 81.06,44.6 J1.1 | 67.7,44.63 J2.2
  Bottom 0.762: J2.2 J2.1 | J1.1 J1.2 | v18.8,44.87 19,44.67 v67.67,44.67 v80.99,44.67

### Text on the board
Top: rev. 0.1
tPlace: PX2 BUS | BOOT | JTAG | PX2FMU v1.3 TEST BOARD | FRONT | PWR | POWER SOURCE | GND | VDD | 3V3 | I2C2 | SDA | I2C2 | SCL | SPI1 | MOSI | SPI1 | MISO | SPI1 | SCK | USB | EXT
tDocu: 5.0V | 5.0V | 3.3V | 3.3V
bDocu: RESET | USB | VDD_5V | JTAG | 1 | VDD_3V3 | I2C1_SCL | EXTERNAL | I2C1_SDA | USART2_TX | BOOT0 | POWER | ACTIVITY | ERROR | USART2_CTS | USART2_RTS | USART2_TX | USART1_TX | USART1_RX | EXPANSION | PPM INPUT | GPIO2 | GPIO1 | BATTERY | GND | PX2 FMU | 15 | FLIGHT | MANAGEMENT | SCL | MOSI | UNIT | GPS | SDA | MISO | SCK | v0.6